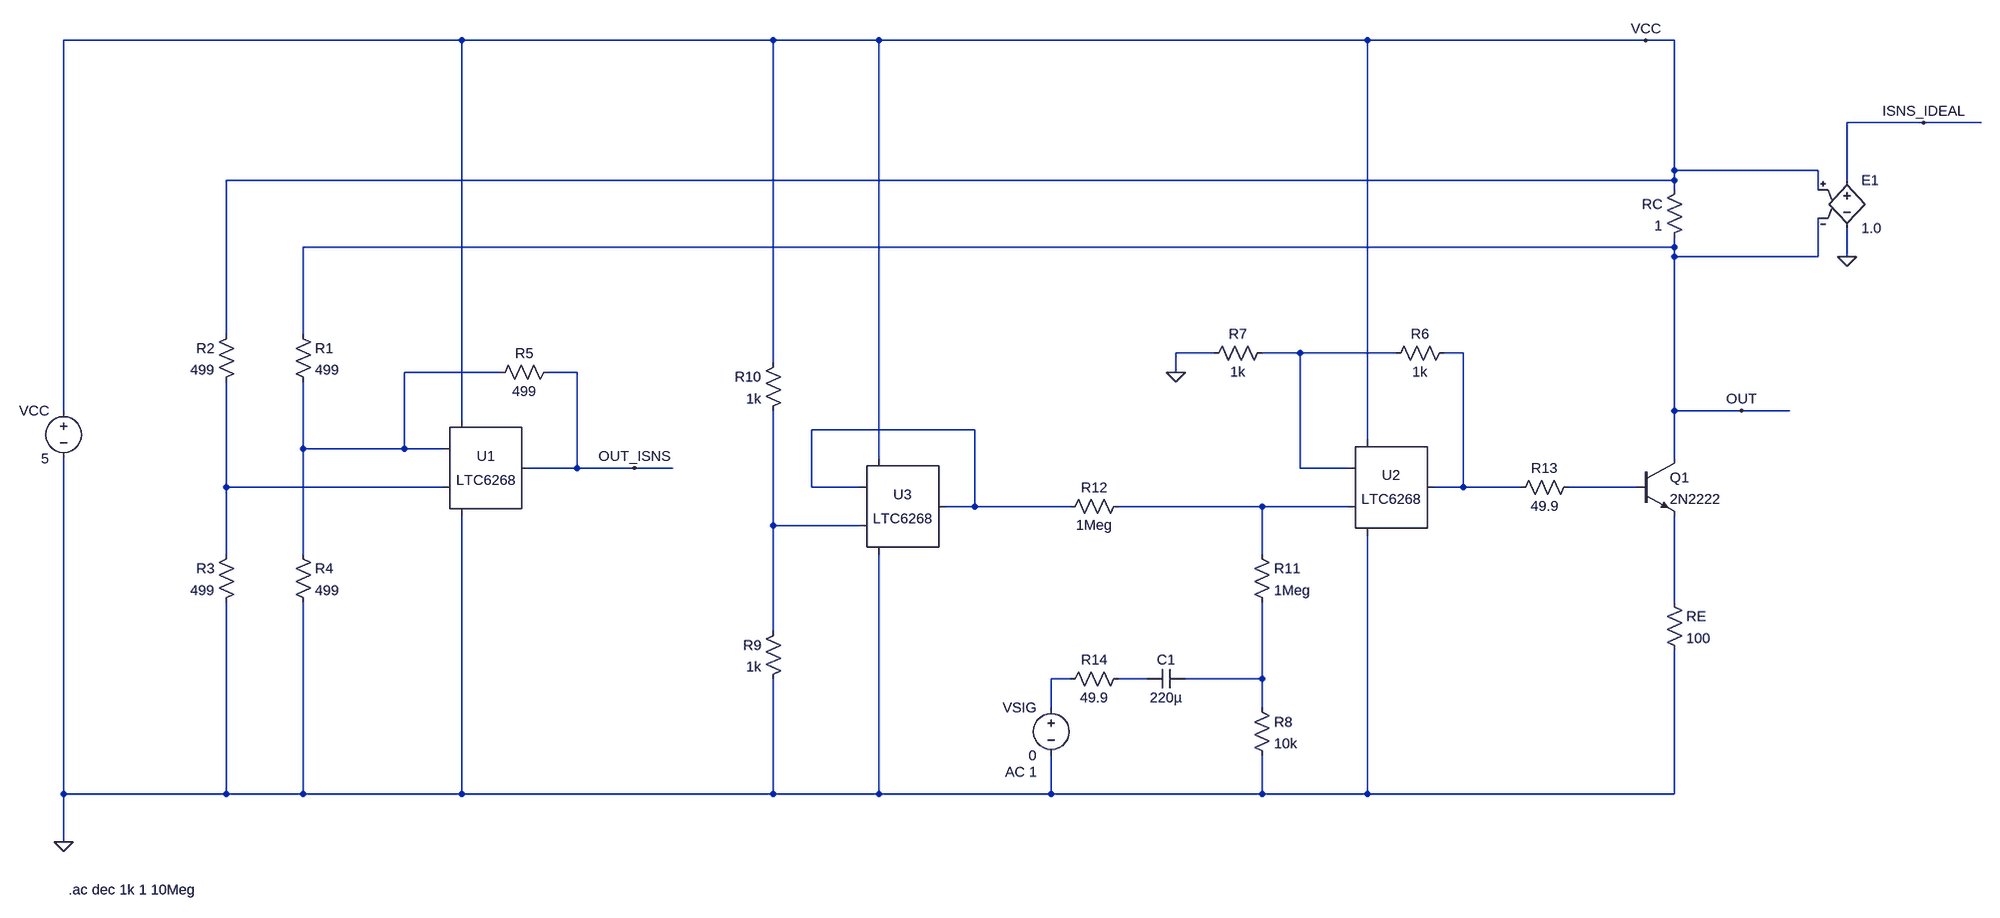
[diagram p0: schematic Common_Emitter_w_Degeneration_Freq_Response.asc]
Common_Emitter_w_Degeneration_Freq_Response.asc, the LTspice schematic file:
Version 4.1
SHEET 1 2948 2456
WIRE -400 -1040 -1152 -1040
WIRE 320 -1040 -400 -1040
WIRE 496 -1040 320 -1040
WIRE 1312 -1040 496 -1040
WIRE 1792 -1040 1312 -1040
WIRE 1840 -1040 1792 -1040
WIRE 2256 -704 2128 -704
WIRE 2352 -704 2256 -704
WIRE 1840 -624 1840 -1040
WIRE 2080 -624 1840 -624
WIRE 1840 -608 1840 -624
WIRE 1840 -608 -880 -608
WIRE 2128 -608 2128 -704
WIRE 1840 -592 1840 -608
WIRE 2080 -592 2080 -624
WIRE 1840 -496 1840 -512
WIRE 1840 -496 -720 -496
WIRE 1840 -480 1840 -496
WIRE 2080 -480 2080 -544
WIRE 2080 -480 1840 -480
WIRE 2128 -480 2128 -528
WIRE -880 -176 -880 -608
WIRE -720 -176 -720 -496
WIRE 1056 -144 992 -144
WIRE 1200 -144 1136 -144
WIRE 1360 -144 1200 -144
WIRE 1472 -144 1440 -144
WIRE 320 -128 320 -1040
WIRE -336 -112 -496 -112
WIRE -208 -112 -256 -112
WIRE 992 -112 992 -144
WIRE -1152 -48 -1152 -1040
WIRE 1840 -48 1840 -480
WIRE 1952 -48 1840 -48
WIRE 2032 -48 1952 -48
WIRE -400 -32 -400 -1040
WIRE 656 -16 384 -16
WIRE 1312 0 1312 -1040
WIRE -720 16 -720 -96
WIRE -496 16 -496 -112
WIRE -496 16 -720 16
WIRE -432 16 -496 16
WIRE 496 32 496 -1040
WIRE 1840 32 1840 -48
WIRE -208 48 -208 -112
WIRE -208 48 -288 48
WIRE -112 48 -208 48
WIRE -48 48 -112 48
WIRE 1200 48 1200 -144
WIRE 1280 48 1200 48
WIRE -880 80 -880 -96
WIRE -432 80 -880 80
WIRE 384 80 384 -16
WIRE 464 80 384 80
WIRE 1472 80 1472 -144
WIRE 1472 80 1424 80
WIRE 1568 80 1472 80
WIRE 1776 80 1648 80
WIRE 656 112 656 -16
WIRE 656 112 608 112
WIRE 816 112 656 112
WIRE 1136 112 896 112
WIRE 1280 112 1136 112
WIRE 320 144 320 -48
WIRE 464 144 320 144
WIRE -880 192 -880 80
WIRE -720 192 -720 16
WIRE 1136 192 1136 112
WIRE 1840 272 1840 128
WIRE 320 320 320 144
WIRE 816 400 784 400
WIRE 944 400 896 400
WIRE 1136 400 1136 272
WIRE 1136 400 1008 400
WIRE 784 448 784 400
WIRE 1136 448 1136 400
WIRE -1152 592 -1152 32
WIRE -880 592 -880 272
WIRE -880 592 -1152 592
WIRE -720 592 -720 272
WIRE -720 592 -880 592
WIRE -400 592 -400 128
WIRE -400 592 -720 592
WIRE 320 592 320 400
WIRE 320 592 -400 592
WIRE 496 592 496 192
WIRE 496 592 320 592
WIRE 784 592 784 528
WIRE 784 592 496 592
WIRE 1136 592 1136 528
WIRE 1136 592 784 592
WIRE 1312 592 1312 160
WIRE 1312 592 1136 592
WIRE 1840 592 1840 352
WIRE 1840 592 1312 592
WIRE -1152 672 -1152 592
FLAG -1152 672 0
FLAG 2128 -480 0
FLAG 2256 -704 ISNS_IDEAL
FLAG 1792 -1040 VCC
FLAG 1952 -48 OUT
FLAG -112 48 OUT_ISNS
FLAG 992 -112 0
SYMBOL npn 1776 32 R0
SYMATTR InstName Q1
SYMATTR Value 2N2222
SYMBOL res 1824 256 R0
SYMATTR InstName RE
SYMATTR Value 100
SYMBOL res 1856 -608 M0
SYMATTR InstName RC
SYMATTR Value 1
SYMBOL voltage -1152 -64 M0
WINDOW 123 0 0 Left 0
WINDOW 39 0 0 Left 0
SYMATTR InstName VCC
SYMATTR Value 5
SYMBOL e 2128 -624 R0
SYMATTR InstName E1
SYMATTR Value 1.0
SYMBOL OpAmps\\LTC6268 -400 48 R0
SYMATTR InstName U1
SYMBOL res -736 -192 R0
SYMATTR InstName R1
SYMATTR Value 499
SYMBOL res -864 -192 M0
SYMATTR InstName R2
SYMATTR Value 499
SYMBOL res -864 176 M0
SYMATTR InstName R3
SYMATTR Value 499
SYMBOL res -736 176 R0
SYMATTR InstName R4
SYMATTR Value 499
SYMBOL res -352 -96 R270
WINDOW 0 32 56 VTop 2
WINDOW 3 0 56 VBottom 2
SYMATTR InstName R5
SYMATTR Value 499
SYMBOL res 1552 96 R270
WINDOW 0 32 56 VTop 2
WINDOW 3 0 56 VBottom 2
SYMATTR InstName R13
SYMATTR Value 49.9
SYMBOL OpAmps\\LTC6268 1312 80 R0
SYMATTR InstName U2
SYMBOL res 1344 -128 R270
WINDOW 0 32 56 VTop 2
WINDOW 3 0 56 VBottom 2
SYMATTR InstName R6
SYMATTR Value 1k
SYMBOL res 1040 -128 R270
WINDOW 0 32 56 VTop 2
WINDOW 3 0 56 VBottom 2
SYMATTR InstName R7
SYMATTR Value 1k
SYMBOL res 1120 432 R0
SYMATTR InstName R8
SYMATTR Value 10k
SYMBOL res 336 304 M0
SYMATTR InstName R9
SYMATTR Value 1k
SYMBOL res 336 -144 M0
SYMATTR InstName R10
SYMATTR Value 1k
SYMBOL res 1120 176 R0
SYMATTR InstName R11
SYMATTR Value 1Meg
SYMBOL voltage 784 432 M0
WINDOW 123 24 124 Left 2
WINDOW 39 0 0 Left 0
SYMATTR Value2 AC 1
SYMATTR InstName VSIG
SYMATTR Value 0
SYMBOL OpAmps\\LTC6268 496 112 R0
SYMATTR InstName U3
SYMBOL res 800 128 R270
WINDOW 0 32 56 VTop 2
WINDOW 3 0 56 VBottom 2
SYMATTR InstName R12
SYMATTR Value 1Meg
SYMBOL res 800 416 R270
WINDOW 0 32 56 VTop 2
WINDOW 3 0 56 VBottom 2
SYMATTR InstName R14
SYMATTR Value 49.9
SYMBOL cap 944 416 R270
WINDOW 0 32 32 VTop 2
WINDOW 3 0 32 VBottom 2
SYMATTR InstName C1
SYMATTR Value 220µ
TEXT -1144 752 Left 2 !.ac dec 1k 1 10Meg

The netlist it stands for:
* Common_Emitter_w_Degeneration_Freq_Response.asc
Q1 OUT N006 N009 0 2N2222
RE N009 0 100
RC VCC OUT 1
VCC VCC 0 5
E1 ISNS_IDEAL 0 VCC OUT 1.0
X§U1 N005 N003 OUT_ISNS VCC 0 NC_01 LTC6268
R1 OUT N003 499
R2 VCC N005 499
R3 N005 0 499
R4 N003 0 499
R5 N003 OUT_ISNS 499
R13 N002 N006 49.9
X§U2 N007 N001 N002 VCC 0 NC_02 LTC6268
R6 N001 N002 1k
R7 0 N001 1k
R8 N012 0 10k
R9 N008 0 1k
R10 VCC N008 1k
R11 N007 N012 1Meg
VSIG N010 0 0 AC 1
X§U3 N008 N004 N004 VCC 0 NC_03 LTC6268
R12 N004 N007 1Meg
R14 N010 N011 49.9
C1 N011 N012 220µ
.model NPN NPN
.model PNP PNP
.lib standard.bjt
.ac dec 1k 1 10Meg
.lib LTC2.lib
.backanno
.end